# Altium schematic sheet AES50B.SchDoc
size A4; SheetNumber: 2; SheetTotal: 2
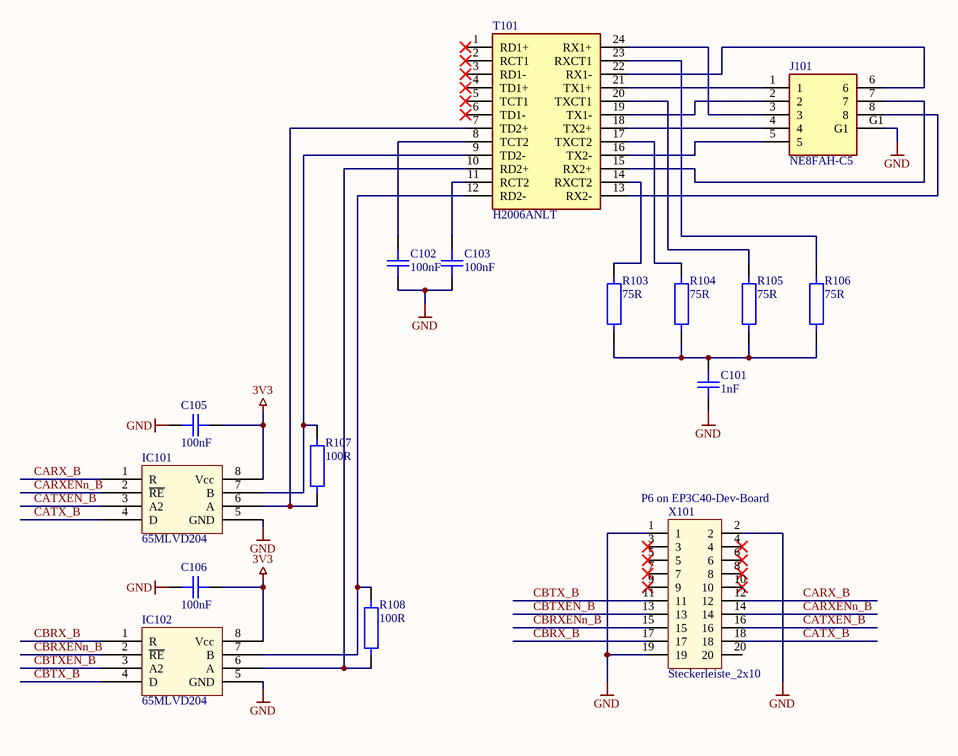
[diagram p0: AES50B.SchDoc]

## Parts
C101  1nF  [1206]
C102  100nF  [1206]
C103  100nF  [1206]
C105  100nF  [1206]
C106  100nF  [1206]
IC101  65MLVD204  [SOIC-8]
IC102  65MLVD204  [SOIC-8]
J101  NE8FAH-C5  [NE8FAHC5]
R103  75R  [1206]
R104  75R  [1206]
R105  75R  [1206]
R106  75R  [1206]
R107  100R  [1206]
R108  100R  [1206]
T101  H2006ANLT  [H2006ANLT]
X101  Steckerleiste_2x10  [steckerleiste_2x10]

## Nets
3V3: C105.1 C106.1 IC101.8(Vcc) IC102.8(Vcc)
GND: C101.2 C102.2 C103.2 C105.2 C106.2 IC101.5(GND) IC102.5(GND) J101.G1 X101.1 X101.2 X101.19
CARX_B: IC101.1(R) X101.12
CARXENn_B: IC101.2(~{RE}) X101.14
CATX_B: IC101.4(D) X101.18
CATXEN_B: IC101.3(A2) X101.16
CBRX_B: IC102.1(R) X101.17
CBRXENn_B: IC102.2(~{RE}) X101.15
CBTX_B: IC102.4(D) X101.11
CBTXEN_B: IC102.3(A2) X101.13
NetC101_1: C101.1 R103.1 R104.1 R105.1 R106.1
NetC102_1: C102.1 T101.8(TCT2)
NetC103_1: C103.1 T101.11(RCT2)
NetIC101_6: IC101.6(A) R107.1 T101.7(TD2+)
NetIC101_7: IC101.7(B) R107.2 T101.9(TD2-)
NetIC102_6: IC102.6(A) R108.1 T101.10(RD2+)
NetIC102_7: IC102.7(B) R108.2 T101.12(RD2-)
NetJ101_1: J101.1 T101.21(TX1+)
NetJ101_2: J101.2 T101.19(TX1-)
NetJ101_3: J101.3 T101.24(RX1+)
NetJ101_4: J101.4 T101.18(TX2+)
NetJ101_5: J101.5 T101.16(TX2-)
NetJ101_6: J101.6 T101.22(RX1-)
NetJ101_7: J101.7 T101.15(RX2+)
NetJ101_8: J101.8 T101.13(RX2-)
NetR103_2: R103.2 T101.14(RXCT2)
NetR104_2: R104.2 T101.17(TXCT2)
NetR105_2: R105.2 T101.20(TXCT1)
NetR106_2: R106.2 T101.23(RXCT1)

Not connected (* = marked no-connect by the designer): T101 1(RD1+)* 2(RCT1)* 3(RD1-)* 4(TD1+)* 5(TCT1)* 6(TD1-)*; X101 3* 4* 5* 6* 7* 8* 9* 10* 20

## Notes on the sheet
- (near X101) P6 on EP3C40-Dev-Board

## Library data of the parts
C101-C103 C105 C106 = 1206_C_1nF/63V: 1206_C; Text Field1: 06-23225; SMA-ArtikelNr: *
J101 = NE8FAH-C5: Connector; Manufacturer_Name: Neutrik; Datasheet Link: https://www.neutrik.com/media/10049/download/ne8fah-c5-1.pdf?v=1; Height: 28.7mm; Manufacturer_Part_Number: NE8FAH-C5; Mouser Part Number: 568-NE8FAH-C5; Mouser Price/Stock: https://www.mouser.co.uk/ProductDetail/Neutrik/NE8FAH-C5?qs=yAJ577jGV73mSHthIeMdNw%3D%3D
R103-R108 = 1206_R: SMA-ArtikelNr: *
T101 = H2006ANLT: Transformer; Manufacturer_Name: Pulse Electronics; Datasheet Link: https://componentsearchengine.com/Datasheets/1/H2006ANLT.pdf; Height: 6.22mm; Manufacturer_Part_Number: H2006ANLT; Mouser Part Number: 673-H2006ANLT; Mouser Price/Stock: https://www.mouser.co.uk/ProductDetail/Pulse-Electronics/H2006ANLT?qs=4b8myOmUP%252Bsybzhc9Gv5ow%3D%3D; Arrow Part Number: H2006ANLT; Arrow Price/Stock: https://www.arrow.com/en/products/h2006anlt/pulse-electronics-corporation?region=nac